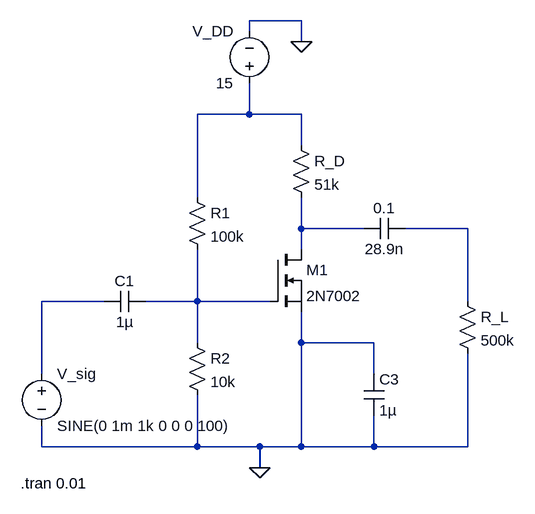
[diagram p0: schematic 25DIPEE06-Madan GP.asc]
25DIPEE06-Madan GP.asc, the LTspice schematic file:
Version 4.1
SHEET 1 880 680
WIRE 368 -192 288 -192
WIRE 288 -176 288 -192
WIRE 368 -160 368 -192
WIRE 288 -48 288 -96
WIRE 288 -48 208 -48
WIRE 368 -48 288 -48
WIRE 368 0 368 -48
WIRE 208 80 208 -48
WIRE 368 128 368 80
WIRE 464 128 368 128
WIRE 624 128 528 128
WIRE 368 160 368 128
WIRE 64 240 -32 240
WIRE 208 240 208 160
WIRE 208 240 128 240
WIRE 320 240 208 240
WIRE 624 240 624 128
WIRE 208 304 208 240
WIRE 368 304 368 256
WIRE 480 304 368 304
WIRE -32 352 -32 240
WIRE 480 352 480 304
WIRE -32 464 -32 432
WIRE 208 464 208 384
WIRE 208 464 -32 464
WIRE 304 464 208 464
WIRE 368 464 368 304
WIRE 368 464 304 464
WIRE 480 464 480 416
WIRE 480 464 368 464
WIRE 624 464 624 320
WIRE 624 464 480 464
WIRE 304 496 304 464
FLAG 304 496 0
FLAG 368 -160 0
SYMBOL res 352 -16 R0
SYMATTR InstName R_D
SYMATTR Value 51k
SYMBOL cap 464 352 R0
SYMATTR InstName C3
SYMATTR Value 1µ
SYMBOL cap 528 112 R90
WINDOW 0 0 32 VBottom 2
WINDOW 3 32 32 VTop 2
SYMATTR InstName 0.1
SYMATTR Value 28.9n
SYMBOL res 608 224 R0
SYMATTR InstName R_L
SYMATTR Value 500k
SYMBOL res 192 64 R0
SYMATTR InstName R1
SYMATTR Value 100k
SYMBOL res 192 288 R0
SYMATTR InstName R2
SYMATTR Value 10k
SYMBOL cap 128 224 R90
WINDOW 0 0 32 VBottom 2
WINDOW 3 32 32 VTop 2
SYMATTR InstName C1
SYMATTR Value 1µ
SYMBOL voltage 288 -80 R180
WINDOW 0 24 96 Left 2
WINDOW 3 24 16 Left 2
WINDOW 123 0 0 Left 0
WINDOW 39 0 0 Left 0
SYMATTR InstName V_DD
SYMATTR Value 15
SYMBOL voltage -32 336 R0
WINDOW 123 0 0 Left 0
WINDOW 39 0 0 Left 0
SYMATTR InstName V_sig
SYMATTR Value SINE(0 1m 1k 0 0 0 100)
SYMBOL nmos 320 160 R0
SYMATTR InstName M1
SYMATTR Value 2N7002
TEXT -64 520 Left 2 !.tran 0.01

The netlist it stands for:
* 25DIPEE06-Madan GP.asc
R_D N001 N002 51k
C3 0 0 1µ
C§0.1 N003 N002 28.9n
R_L N003 0 500k
R1 N001 N005 100k
R2 N005 0 10k
C1 N005 N004 1µ
V_DD N001 0 15
V_sig N004 0 SINE(0 1m 1k 0 0 0 100)
M1 N002 N005 0 0 2N7002
.model NMOS NMOS
.model PMOS PMOS
.lib standard.mos
.tran 0.01
.backanno
.end